# Altium schematic sheet Power.SchDoc: Power
size A4; DrawnBy: Brain-Yao; DocumentNumber: 3; Revision: 1.0; SheetNumber: 3; SheetTotal: 3; ProjectName: Stethoscope
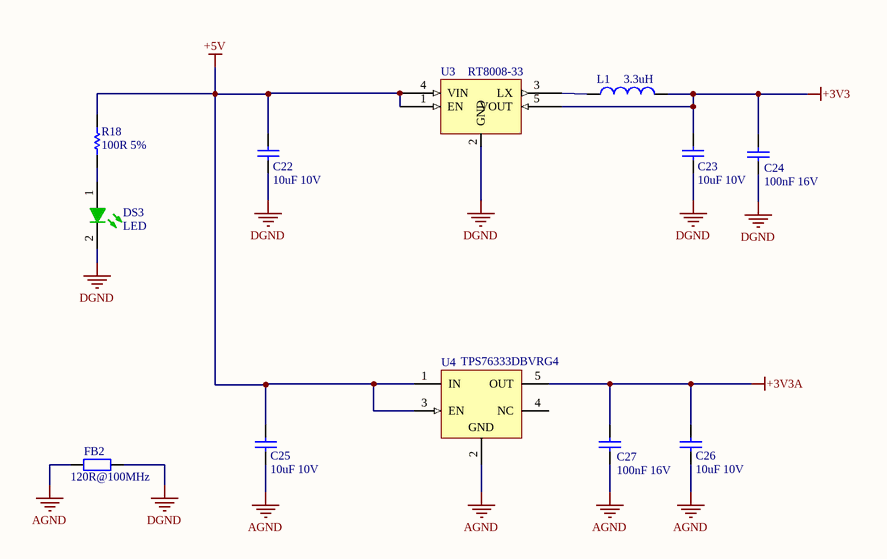
[diagram p0: Power.SchDoc]

## Parts
C22  10uF 10V  [CAPC0603(1608)100_M]
C23  10uF 10V  [CAPC0603(1608)100_M]
C24  100nF 16V  [CAPC0603(1608)100_M]
C25  10uF 10V  [CAPC0603(1608)100_M]
C26  10uF 10V  [CAPC0603(1608)100_M]
C27  100nF 16V  [CAPC0603(1608)100_M]
DS3  LED  [KING-0603LED_GREEN_V]
FB2  120R@100MHz  [RESC1608N]
L1  3.3uH  [INDC2012N]
R18  100R 5%  [RESC0603(1608)_M]
U3  RT8008-33  [SOT23-5AN]
U4  TPS76333DBVRG4  [TI-DBV5_N]

## Nets
+3V3: C23.2 C24.2 L1.2 U3.5(VOUT)
+3V3A: C26.2 C27.2 U4.5(OUT)
+5V: C22.2 C25.2 R18.2 U3.1(EN) U3.4(VIN) U4.1(IN) U4.3(EN)
AGND: C25.1 C26.1 C27.1 FB2.1 U4.2(GND)
DGND: C22.1 C23.1 C24.1 DS3.2(K) FB2.2 U3.2(GND)
NetDS3_1: DS3.1(A) R18.1
NetL1_1: L1.1 U3.3(LX)

Not connected (* = marked no-connect by the designer): U4 4(NC)

## Notes on the sheet
- Title
- Size:
- Date:
- A4
- Number:
- Time:
- Revision:
- Sheet
- of
- File:

## Library data of the parts
C22 C23 C25 C26 = CMP-1035-02799-1: CAP 10uF 10V ±10% 0603 (1608 Metric) Thickness 1mm SMD; Case-Metric: 1608; Case-EIA: 0603; Max Thickness: 1 mm; Tolerance: ±10%; Technology: SMT; Rated Voltage: 10 V; Value: 10uF
C24 C27 = CMP-1035-02584-1: CAP 100nF 16V ±10% 0603 (1608 Metric) Thickness 1mm SMD; Case-EIA: 0603; Case-Metric: 1608; Tolerance: ±10%; Technology: SMT; Max Thickness: 1 mm; Value: 100nF; Rated Voltage: 16 V
DS3 = CMP-0404-00001-1: LED, SMT, 0603(1608), 1.1mm thickness, Green; Manufacturer: Kingbright; PartNumber: KP-1608MGC; Reverse Voltage: 5 V; Power Dissipation: 75 mW; Forward Current: 30 mA; Packing Type: 2000 pcs / reel; Mounting Technology: Surface Mount; Storage Temperature: -40 to +85 degC; ComponentLink1URL: http://www.kingbright.com/; PackageDescription: 2-Pin SMT LED, 1.6 x 0.8 mm Pitch; PackageReference: 0603LED_GREEN; ComponentLink1Description: Manufacturer URL
FB2 = Res2: Resistor; Published: 8-Jun-2000; LatestRevisionDate: 17-Jul-2002; LatestRevisionNote: Re-released for DXP Platform.; PackageReference: AXIAL-0.4; Publisher: Altium Limited; PackageDescription: Axial Device, Thru-Hole; 2 Leads; 0.4 in Pin Spacing; Value: 120R@100MHz
L1 = Inductor: Code_IEC: 1005; Published: 8-Jun-2000; LatestRevisionDate: 29-May-2009; LatestRevisionNote: IPC-7351 Footprint Added.; PackageReference: 0402-A; Publisher: Altium Limited; PackageDescription: Chip Inductor; Code_JEITA: 0402; Value: 3.3uH
R18 = CMP-1012-00050-1: 100R 0.1W 5% 0603 (1608 Metric)  SMD; Case-EIA: 0603; Value: 100.00 Ohm; Case-Metric: 1608; Tolerance: 5 %; Technology: SMT; Power: 0.1 W
U3 = RT8008
U4 = CMP-0394-00568-1: Single Output LDO, 150 mA, Fixed 3.3 V Output, 2.7 to 10 V Input, with Low IQ, 5-pin SOT-23 (DBV), -40 to 125 degC, Green (RoHS & no Sb/Br); Manufacturer: Texas Instruments; Vout Adj(Max)(V): 3.3; Vin(Min)(V): 2.7; Vdo(Typ)(mV): 300; Accuracy(%): 3; Iq(Typ)(mA): 0.08; SubFamily: Single Channel LDO; Vin(Max)(V): 10; Iout(Max)(A): 0.15; DatasheetVersion: SLVS181H; ComponentLink1URL: http://www.ti.com/; Eco-Plan: Green (RoHS & no Sb/Br); PartNumber: TPS76333DBVRG4; PackageDescription: 5-Pin Plastic Small Outline, Body 1.60 Ã— 2.90 mm, Pitch 0.95 mm; ComponentLink1Description: Manufacturer URL; PackageVersion: 4073253-4/K; ComponentLink3URL: http://www.ti.com/litv/pdf/mpds018i; ComponentLink2URL: http://www.ti.com/general/docs/lit/getliterature.tsp?genericPartNumber=TPS76333&fileType=pdf; Fixed Output Options(V): 3.3; Vout Adj(Min)(V): 3.3; ComponentLink3Description: Package Specification; Mounting Technology: Surface Mount; Code_JEDEC: MO-178; ComponentLink2Description: Datasheet; PackageReference: DBV5